# EAGLE design Precharge_circuit_logic_TNN_V1.0 (EAGLE 9.6.2)
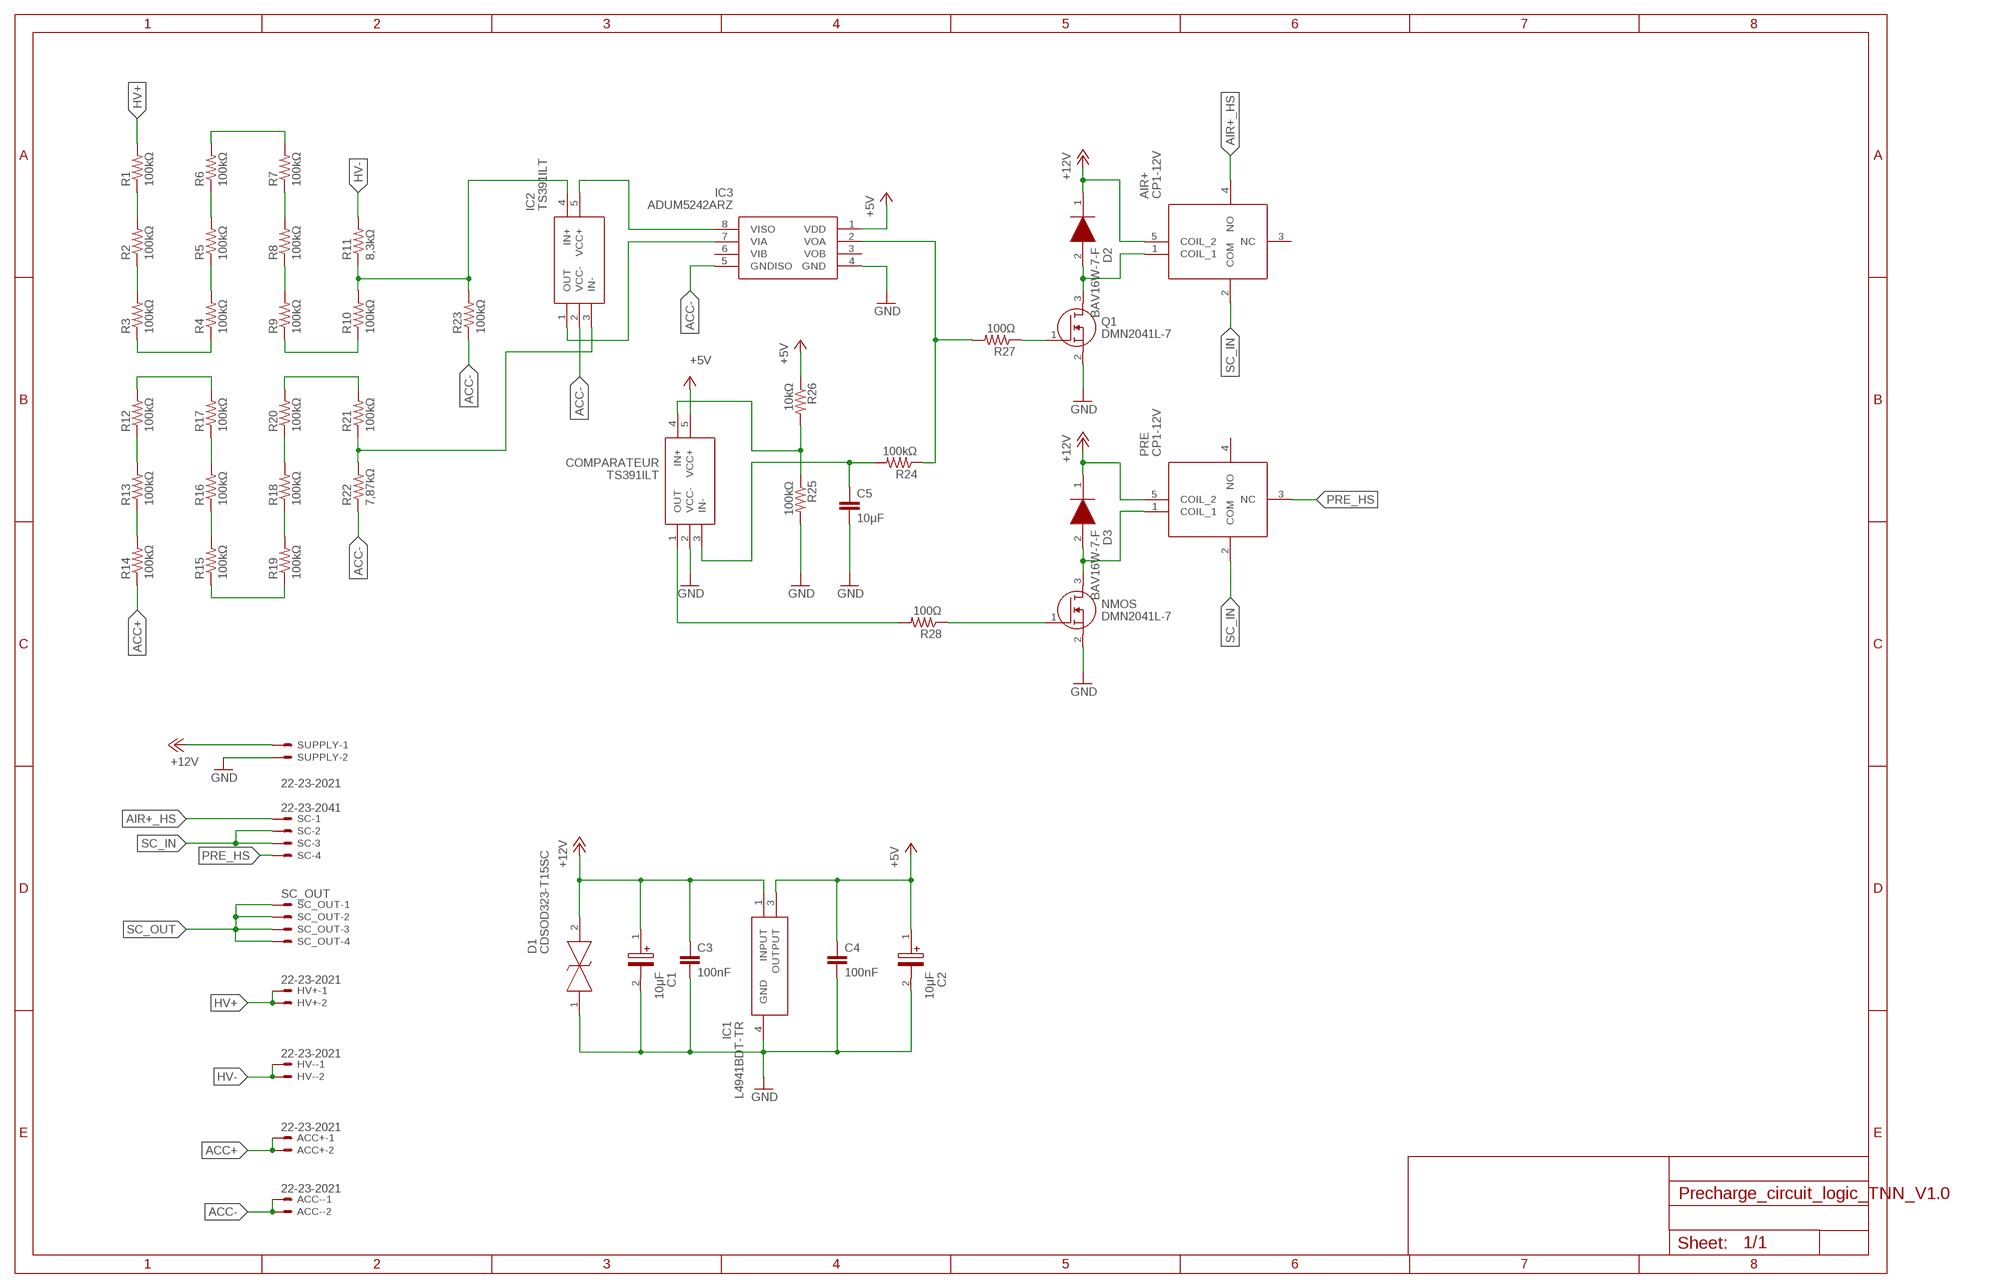
[diagram p0: schematic, sheet 1]

## Parts
ACC+  22-23-2021  [22-23-2021]
ACC-  22-23-2021  [22-23-2021]
AIR+  CP1-12V  [CP1FORMC_1]
C1  10μF  ECA1VM100  [CAPPRD200W55D525H1200]
C2  10μF  ECA1VM100  [CAPPRD200W55D525H1200]
C3  100nF  C-EUC0603  [C0603]
C4  100nF  C-EUC0603  [C0603]
C5  10μF  C-EUC0603  [C0603]
COMPARATEUR  TS391ILT  [SOT95P280X145-5N]
D1  CDSOD323-T15SC  [SOD-323]
D2  BAV16W-7-F  [SOD3716X145N]
D3  BAV16W-7-F  [SOD3716X145N]
HV+  22-23-2021  [22-23-2021]
HV-  22-23-2021  [22-23-2021]
IC1  L4941BDT-TR  [TO228P972X240-3N]
IC2  TS391ILT  [SOT95P280X145-5N]
IC3  ADUM5242ARZ  [SOIC127P600X175-8N]
NMOS  DMN2041L-7  [SOT96P240X110-3N]
PRE  CP1-12V  [CP1FORMC_1]
Q1  DMN2041L-7  [SOT96P240X110-3N]
R1  100kΩ  R-US_R0603  [R0603]
R2  100kΩ  R-US_R0603  [R0603]
R3  100kΩ  R-US_R0603  [R0603]
R4  100kΩ  R-US_R0603  [R0603]
R5  100kΩ  R-US_R0603  [R0603]
R6  100kΩ  R-US_R0603  [R0603]
R7  100kΩ  R-US_R0603  [R0603]
R8  100kΩ  R-US_R0603  [R0603]
R9  100kΩ  R-US_R0603  [R0603]
R10  100kΩ  R-US_R0603  [R0603]
R11  8,3kΩ  R-US_R0603  [R0603]
R12  100kΩ  R-US_R0603  [R0603]
R13  100kΩ  R-US_R0603  [R0603]
R14  100kΩ  R-US_R0603  [R0603]
R15  100kΩ  R-US_R0603  [R0603]
R16  100kΩ  R-US_R0603  [R0603]
R17  100kΩ  R-US_R0603  [R0603]
R18  100kΩ  R-US_R0603  [R0603]
R19  100kΩ  R-US_R0603  [R0603]
R20  100kΩ  R-US_R0603  [R0603]
R21  100kΩ  R-US_R0603  [R0603]
R22  7,87kΩ  R-US_R0603  [R0603]
R23  100kΩ  R-US_R0603  [R0603]
R24  100kΩ  R-US_R0603  [R0603]
R25  100kΩ  R-US_R0603  [R0603]
R26  10kΩ  R-US_R0603  [R0603]
R27  100Ω  R-US_R0603  [R0603]
R28  100Ω  R-US_R0603  [R0603]
SC  22-23-2041  [22-23-2041]
SC_OUT  SC_OUT  22-23-2041  [22-23-2041]
SUPPLY  22-23-2021  [22-23-2021]

## Nets
+5V: C2.1(+) C4.1 COMPARATEUR.5(VCC+) IC1.3(OUTPUT) IC3.1(VDD) R26.1
+12V: AIR+.5(COIL_2) C1.1(+) C3.1 D1.2 D2.1(K) D3.1(K) IC1.1(INPUT) PRE.5(COIL_2) SUPPLY.1
ACC+: ACC+.1 ACC+.2 R14.1
ACC-: ACC-.1 ACC-.2 IC2.2(VCC-) IC3.5(GNDISO) R22.1 R23.1
AIR+_HS: AIR+.4(NO) SC.1
GND: C1.2(-) C2.2(-) C3.2 C4.2 C5.2 COMPARATEUR.2(VCC-) D1.1 IC1.4(GND) IC3.4(GND) NMOS.2(S) Q1.2(S) R25.2 SUPPLY.2
HV+: HV+.1 HV+.2 R1.2
HV-: HV-.1 HV-.2 R11.2
N$1: R1.1 R2.2
N$2: R2.1 R3.2
N$3: R3.1 R4.1
N$4: R4.2 R5.1
N$5: R5.2 R6.1
N$6: R6.2 R7.2
N$7: R7.1 R8.2
N$8: R8.1 R9.2
N$9: R9.1 R10.1
N$10: IC2.4(IN+) R10.2 R11.1 R23.2
N$11: IC2.5(VCC+) IC3.8(VISO)
N$12: COMPARATEUR.4(IN+) R25.1 R26.2
N$13: R13.1 R14.2
N$14: R12.1 R13.2
N$15: R12.2 R17.2
N$16: R16.2 R17.1
N$17: R15.2 R16.1
N$18: R15.1 R19.1
N$19: R18.1 R19.2
N$20: R18.2 R20.1
N$21: R20.2 R21.2
N$22: IC2.3(IN-) R21.1 R22.2
N$23: D3.2(A) NMOS.3(D) PRE.1(COIL_1)
N$24: IC2.1(OUT) IC3.7(VIA)
N$25: C5.1 COMPARATEUR.3(IN-) R24.2
N$26: IC3.2(VOA) R24.1 R27.2
N$27: COMPARATEUR.1(OUT) R28.2
N$28: AIR+.1(COIL_1) D2.2(A) Q1.3(D)
N$29: NMOS.1(G) R28.1
N$30: Q1.1(G) R27.1
PRE_HS: PRE.3(NC) SC.4
SC_IN: AIR+.2(COM) PRE.2(COM) SC.2 SC.3
SC_OUT: SC_OUT.1 SC_OUT.2 SC_OUT.3 SC_OUT.4
Unconnected: AIR+.3(NC) IC3.3(VOB) IC3.6(VIB) PRE.4(NO)

## Library data of the parts
ACC+ ACC- HV+ HV- SUPPLY = con-molex:22-23-2021: .100" (2.54mm) Center Header - 2 Pin; MF: MOLEX; MPN: 22-23-2021; OC_FARNELL: 1462926; OC_NEWARK: 25C3832
AIR+ PRE = CP1-12V:CP1-12V: PANASONIC ELECTRIC WORKS - CP1-12V - RELAY, AUTOMOTIVE, SPDT, 14VDC, 20A Source: Datasheet <http://www.farnell.com/datasheets/1809465.pdf>; ARROW_PART_NUMBER: CP1-12V; ARROW_PRICE-STOCK: https://www.arrow.com/en/products/cp1-12v/panasonic?region=nac; DESCRIPTION: PANASONIC ELECTRIC WORKS - CP1-12V - RELAY, AUTOMOTIVE, SPDT, 14VDC, 20A; HEIGHT: mm; MANUFACTURER_NAME: Panasonic; MANUFACTURER_PART_NUMBER: CP1-12V; MOUSER_PART_NUMBER: 769-CP1-12V; MOUSER_PRICE-STOCK: https://www.mouser.co.uk/ProductDetail/Panasonic-Industrial-Devices/CP1-12V?qs=mTeSeKeuVA7dPPafy7M16g%3D%3D
C1 C2 = ECA1VM100:ECA1VM100: M radial Al elect cap,10uF 35V 85deg C Panasonic 10uF 35 V dc Aluminium Electrolytic Capacitor, M Series 2000h Source: Datasheet <http://industrial.panasonic.com/cdbs/www-data/pdf/RDF0000/ABA0000C1218.pdf>; DESCRIPTION: M radial Al elect cap,10uF 35V 85deg C Panasonic 10uF 35 V dc Aluminium Electrolytic Capacitor, M Series 2000h; HEIGHT: 12mm; MANUFACTURER_NAME: Panasonic; MANUFACTURER_PART_NUMBER: ECA1VM100
C3-C5 = rcl:C-EU: CAPACITOR, European symbol; SPICEPREFIX: C
COMPARATEUR IC2 = TS391ILT:TS391ILT: TS391ILT, Comparator Open Collector 0.3us 12 V, 15 V, 18 V, 24 V, 28 V, 3 V, 5 V, 9 V 5-Pin SOT-23 Source: Datasheet <http://www.st.com/st-web-ui/static/active/en/resource/technical/document/datasheet/CD00001660.pdf>; ARROW_PART_NUMBER: TS391ILT; ARROW_PRICE-STOCK: https://www.arrow.com/en/products/ts391ilt/stmicroelectronics?region=nac; DESCRIPTION: TS391ILT, Comparator Open Collector 0.3us 12 V, 15 V, 18 V, 24 V, 28 V, 3 V, 5 V, 9 V 5-Pin SOT-23; HEIGHT: 1.45mm; MANUFACTURER_NAME: STMicroelectronics; MANUFACTURER_PART_NUMBER: TS391ILT; MOUSER_PART_NUMBER: 511-TS391IL; MOUSER_PRICE-STOCK: https://www.mouser.co.uk/ProductDetail/STMicroelectronics/TS391ILT?qs=P8h1tZw8GcB9GWR61XM17g%3D%3D
D1 = CDSOD323-T15SC:CDSOD323-T15SC: TVS Diode ESD 15V BiDirectional SOD323 Bourns CDSOD323-T15SC Bi-Directional TVS Diode, 400W peak, 2-Pin SOD-323 Source: Datasheet <https://datasheet.datasheetarchive.com/originals/distributors/Datasheets-DGA26/1841678.pdf>; ARROW_PART_NUMBER: CDSOD323-T15SC; ARROW_PRICE-STOCK: https://www.arrow.com/en/products/cdsod323-t15sc/bourns?region=nac; DESCRIPTION: TVS Diode ESD 15V BiDirectional SOD323 Bourns CDSOD323-T15SC Bi-Directional TVS Diode, 400W peak, 2-Pin SOD-323; HEIGHT: mm; MANUFACTURER_NAME: Bourns; MANUFACTURER_PART_NUMBER: CDSOD323-T15SC; MOUSER_PART_NUMBER: 652-CDSOD323-T15SC; MOUSER_PRICE-STOCK: https://www.mouser.co.uk/ProductDetail/Bourns/CDSOD323-T15SC?qs=6S5Watp5UnLvz%2FtnS7XuhA%3D%3D
D2 D3 = BAV16W-7-F:BAV16W-7-F: Diode Switching 100V 0.15A 2Pin SOD123 Diodes Inc BAV16W-7-F Switching Diode, 300mA 100V, 2-Pin SOD-123 Source: Datasheet <https://datasheet.datasheetarchive.com/originals/distributors/SFDatasheet-0/sf-0003309.pdf>; ARROW_PART_NUMBER: BAV16W-7-F; ARROW_PRICE-STOCK: https://www.arrow.com/en/products/bav16w-7-f/diodes-incorporated; DESCRIPTION: Diode Switching 100V 0.15A 2Pin SOD123 Diodes Inc BAV16W-7-F Switching Diode, 300mA 100V, 2-Pin SOD-123; HEIGHT: 1.45mm; MANUFACTURER_NAME: Diodes Inc.; MANUFACTURER_PART_NUMBER: BAV16W-7-F; MOUSER_PART_NUMBER: 621-BAV16W-F; MOUSER_PRICE-STOCK: https://www.mouser.co.uk/ProductDetail/Diodes-Incorporated/BAV16W-7-F?qs=Ge55vsXlF7cElS2bbKfO8A%3D%3D
IC1 = L4941BDT-TR:L4941BDT-TR: L4941BDT-TR, Low Dropout Voltage Regulator, 1A, 5 V +/-4%, 3-Pin DPAK Source: Datasheet <http://www.st.com/web/en/resource/technical/document/datasheet/CD00000443.pdf>; ARROW_PART_NUMBER: L4941BDT-TR; ARROW_PRICE-STOCK: https://www.arrow.com/en/products/l4941bdt-tr/stmicroelectronics?region=nac; DESCRIPTION: L4941BDT-TR, Low Dropout Voltage Regulator, 1A, 5 V +/-4%, 3-Pin DPAK; HEIGHT: 2.4mm; MANUFACTURER_NAME: STMicroelectronics; MANUFACTURER_PART_NUMBER: L4941BDT-TR; MOUSER_PART_NUMBER: 511-L4941BDT-TR; MOUSER_PRICE-STOCK: https://www.mouser.co.uk/ProductDetail/STMicroelectronics/L4941BDT-TR?qs=tPFdqECvbMIySYN92F2N4Q%3D%3D
IC3 = ADUM5242ARZ:ADUM5242ARZ: Analog Devices ADUM5242ARZ PCB SMT 2-channel Digital Isolator, 2500 V, 8-Pin SOIC Source: Datasheet; ARROW_PART_NUMBER: ADUM5242ARZ; ARROW_PRICE-STOCK: https://www.arrow.com/en/products/adum5242arz/analog-devices; DESCRIPTION: Analog Devices ADUM5242ARZ PCB SMT 2-channel Digital Isolator, 2500 V, 8-Pin SOIC; HEIGHT: mm; MANUFACTURER_NAME: Analog Devices; MANUFACTURER_PART_NUMBER: ADUM5242ARZ; MOUSER_PART_NUMBER: 584-ADUM5242ARZ; MOUSER_PRICE-STOCK: https://www.mouser.co.uk/ProductDetail/Analog-Devices/ADUM5242ARZ?qs=WIvQP4zGanhQ0%252B41E0Savw%3D%3D
NMOS Q1 = DMN2041L-7:DMN2041L-7: Diodes Inc DMN2041L-7 N-channel MOSFET Transistor, 6.4 A, 20 V, 3-Pin SOT-23 Source: Datasheet <https://datasheet.datasheetarchive.com/originals/distributors/Datasheets-DGA23/1582050.pdf>; ARROW_PART_NUMBER: DMN2041L-7; ARROW_PRICE-STOCK: https://www.arrow.com/en/products/dmn2041l-7/diodes-incorporated?region=nac; DESCRIPTION: Diodes Inc DMN2041L-7 N-channel MOSFET Transistor, 6.4 A, 20 V, 3-Pin SOT-23; HEIGHT: 1.1mm; MANUFACTURER_NAME: Diodes Inc.; MANUFACTURER_PART_NUMBER: DMN2041L-7; MOUSER_PART_NUMBER: 621-DMN2041L-7; MOUSER_PRICE-STOCK: https://www.mouser.co.uk/ProductDetail/Diodes-Incorporated/DMN2041L-7?qs=tiksPeNXt0LSbn3jTreVOg%3D%3D
R1-R28 = rcl:R-US_: RESISTOR, American symbol; SPICEPREFIX: R
SC SC_OUT = con-molex:22-23-2041: .100" (2.54mm) Center Header - 4 Pin; MF: MOLEX; MPN: 22-23-2041; OC_FARNELL: 1462920; OC_NEWARK: 38C0355

## Board
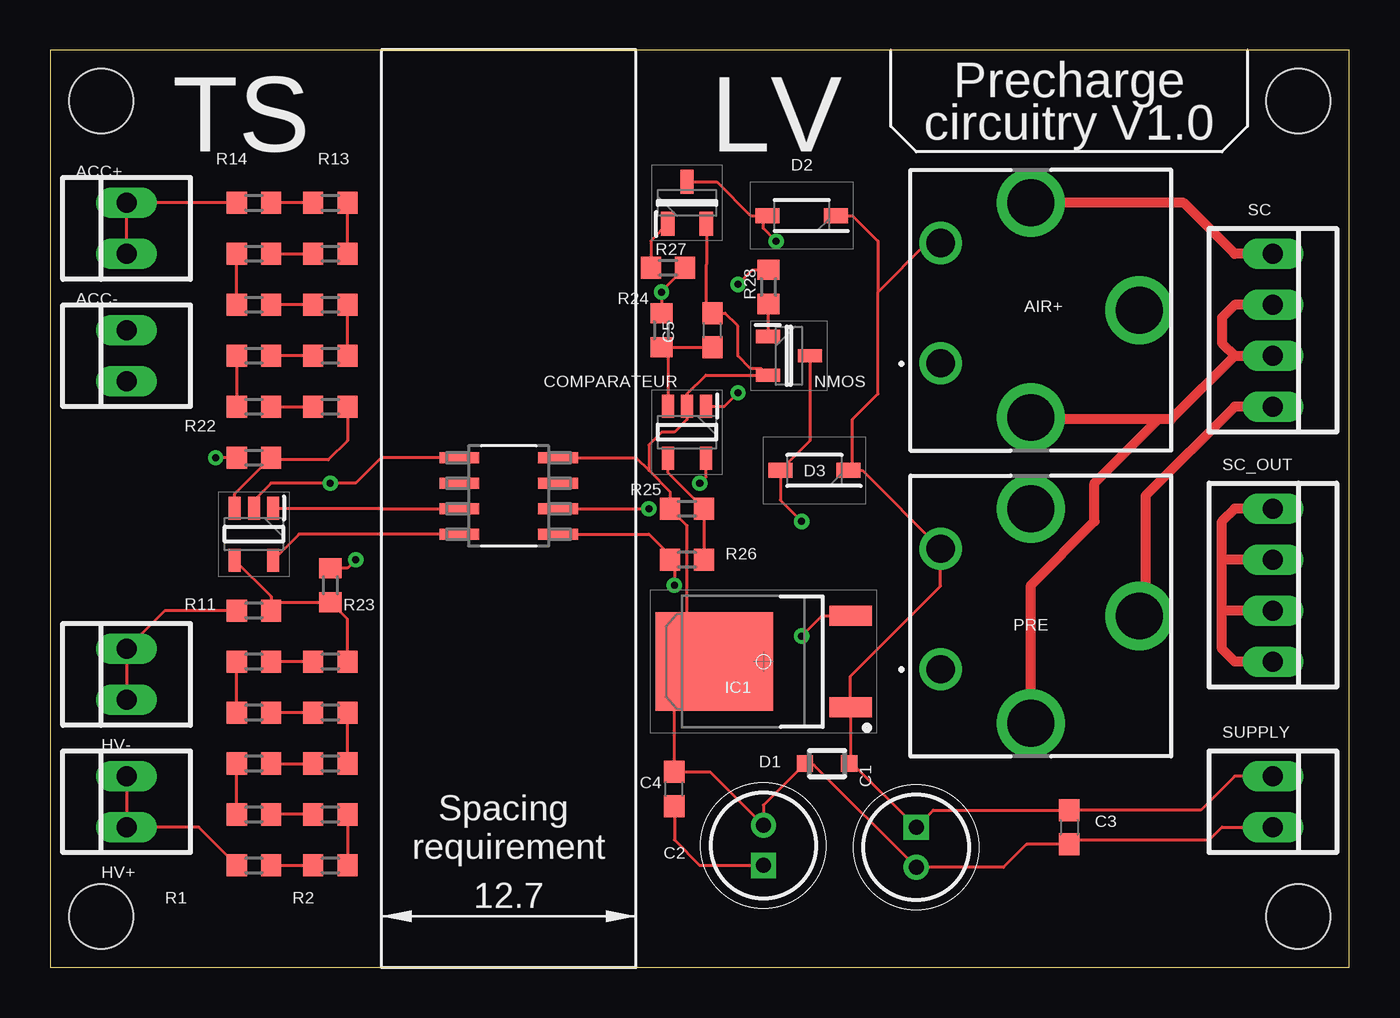
[diagram p1: board, top side]
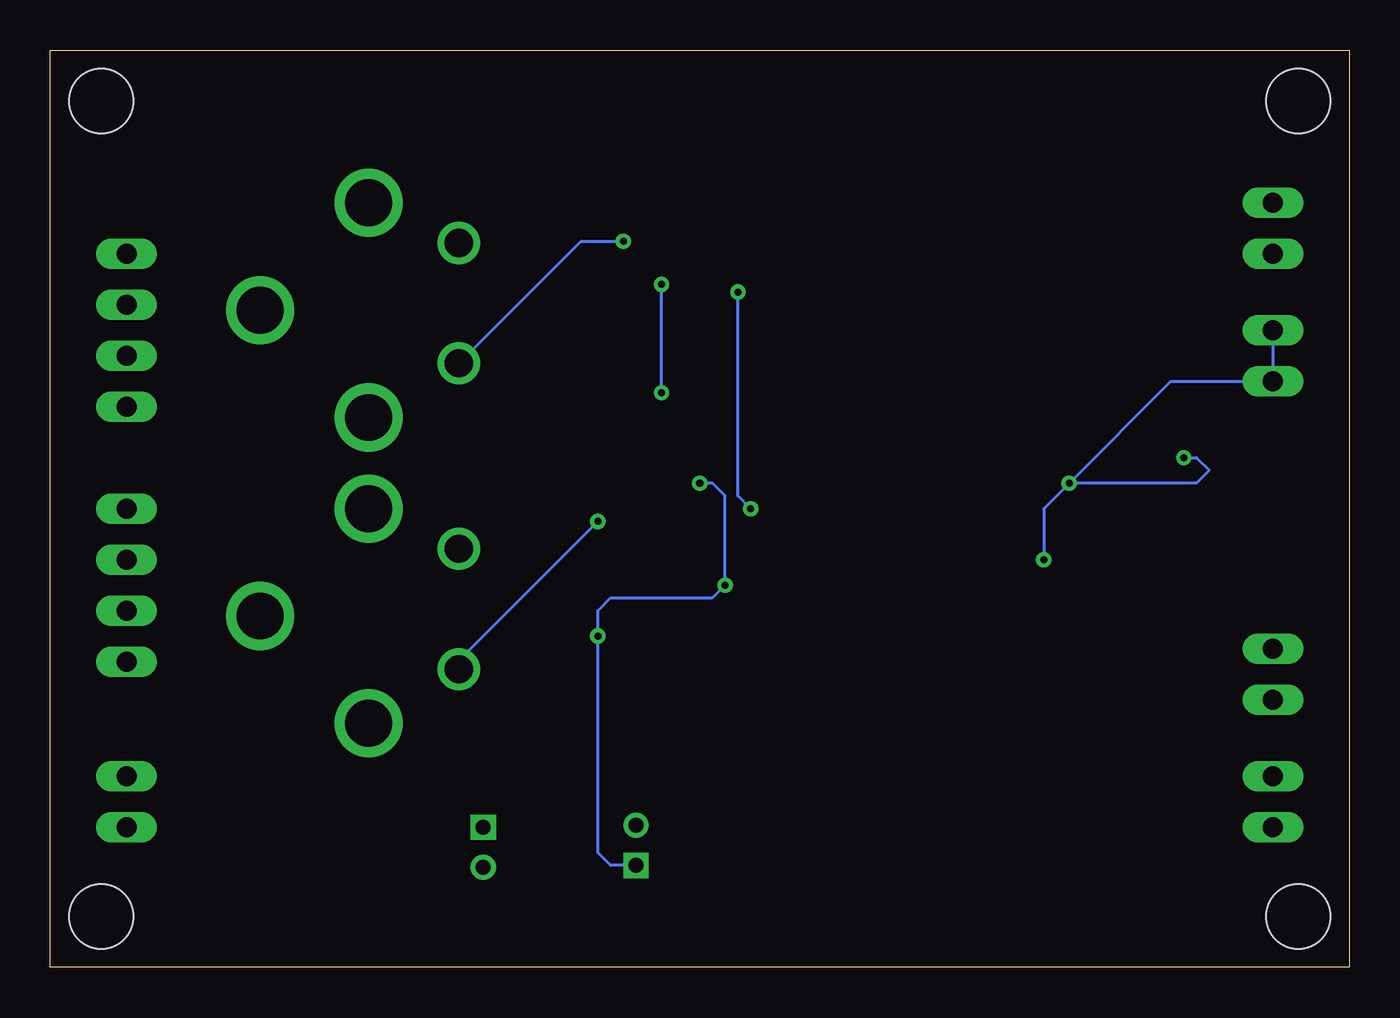
[diagram p2: board, bottom side, seen from below]

Size 64.77 x 45.71 mm. Coordinates in mm from the lower left corner, seen from the top.
Outline: 0,0 64.77,0 64.77,45.71 0,45.71 0,0
Copper layers (1*16): Top 0.035mm / dielectric 1.5mm / Bottom 0.035mm
Design rules "default": minimum track width 6mil, minimum drill 0.35mm, track to track 6mil, track to pad 6mil, pad to pad 6mil, via to via 6mil, smd to smd 6mil, copper to edge 40mil, drill to drill 6mil, minimum pad ring 10mil, minimum via ring 8mil, stop-mask expansion 4mil, vias tented up to drill 0mil, thermal gap 10mil
Holes 3.2 mm at 2.54,43.18 62.23,2.54 2.54,2.54 62.23,43.18

### Footprints (pad centres in the part's own frame; a part is rotated, then mirrored left to right if it is on the bottom)
22-23-2021 = drill 1 long: 1 -1.27,0; 2 1.27,0
CP1FORMC_1 = drill 1.4 pad 2.1: 1 -8,4.5; 5 -2,4.5 | drill 2.33 pad 3.4: 2 -10.7,0; 3 -5.35,-5.4; 4 0,0
CAPPRD200W55D525H1200 = drill 0.75 pad 1.15 square: 1 0,0 | drill 0.75 pad 1.15: 2 2,0
C0603 = smd 1.1 x 1: 1 -0.85,0; 2 0.85,0
SOT95P280X145-5N = smd 1.15 x 0.6: 1 -1.3,0.95; 2 -1.3,0; 3 -1.3,-0.95; 4 1.3,-0.95; 5 1.3,0.95
SOD-323 = smd 0.8 x 0.8: 1 -1.1,0; 2 1.1,0
SOD3716X145N = smd 1.2 x 0.75: 1 -1.7,0; 2 1.7,0
TO228P972X240-3N = smd 2.1 x 1: 1 -4.35,2.28; 3 -4.35,-2.28 | smd 5.85 x 4.9: 4 2.45,0
SOIC127P600X175-8N = smd 1.981 x 0.559: 1 -2.464,1.905; 2 -2.464,0.635; 3 -2.464,-0.635; 4 -2.464,-1.905; 5 2.464,-1.905; 6 2.464,-0.635; 7 2.464,0.635; 8 2.464,1.905
SOT96P240X110-3N = smd 1.2 x 0.65: 1 -1.05,0.96; 2 -1.05,-0.96; 3 1.05,0
R0603 = smd 1 x 1.1: 1 -0.85,0; 2 0.85,0
22-23-2041 = drill 1 long: 1 -3.81,0; 2 -1.27,0; 3 1.27,0; 4 3.81,0

### Placement (x,y rotation side)
ACC+  3.81,36.83 90 top
ACC-  3.81,30.48 90 top
AIR+  48.9,38.1 90 top
C1  43.18,6.98 270 top
C2  35.56,5.08 90 top
C3  50.8,6.98 270 top
C4  31.11,8.89 90 top
C5  33.02,31.75 90 top
COMPARATEUR  31.75,26.67 270 top
D1  38.73,10.16 0 top
D2  37.47,37.47 180 top
D3  38.1,24.77 180 top
HV+  3.81,8.26 90 top
HV-  3.81,14.61 90 top
IC1  35.56,15.24 180 top
IC2  10.16,21.59 270 top
IC3  22.86,23.5 180 top
NMOS  36.83,30.48 0 top
PRE  48.9,22.86 90 top
Q1  31.75,38.1 90 top
R1  10.16,5.08 180 top
R2  13.97,5.08 180 top
R3  13.97,7.62 0 top
R4  10.16,7.62 180 top
R5  10.16,10.16 0 top
R6  13.97,10.16 0 top
R7  13.97,12.7 0 top
R8  10.16,12.7 0 top
R9  10.16,15.24 180 top
R10  13.97,15.24 0 top
R11  10.16,17.78 180 top
R12  13.97,35.56 180 top
R13  13.97,38.1 0 top
R14  10.16,38.1 0 top
R15  13.97,33.02 180 top
R16  10.16,33.02 180 top
R17  10.16,35.56 0 top
R18  10.16,30.48 180 top
R19  13.97,30.48 180 top
R20  10.16,27.94 0 top
R21  13.97,27.94 180 top
R22  10.16,25.4 0 top
R23  13.97,19.05 270 top
R24  30.48,31.75 270 top
R25  31.75,22.86 180 top
R26  31.75,20.32 0 top
R27  30.8,34.86 0 top
R28  35.81,33.91 90 top
SC  60.96,31.75 270 top
SC_OUT  60.96,19.05 270 top
SUPPLY  60.96,8.26 270 top

### Tracks (layer width: path | path; a pad name or v marks a point on that pad's centre or on a via)
+5V  (via drill 0.35)
  Top 0.152: C4.1 31.11,6.35 32.38,5.08 C2.1 | v32.38,24.13 32.7,24.45 COMPARATEUR.5 | IC1.3 38.48,17.52 v37.47,16.51 | R26.1 31.01,20.21 | 31.01,20.21 31.11,20.11 v31.11,19.05 | IC3.1 29.84,21.59 31.01,20.43 31.01,20.21
  Bottom 0.152: C2.1 36.83,5.08 37.47,5.71 v37.47,16.51 37.47,17.78 36.83,18.41 31.75,18.41 v31.11,19.05 31.11,23.5 31.75,24.13 v32.38,24.13
+12V
  Top 0.152: 41.27,33.66 41.27,28.57 40.01,27.3 40.01,24.97 D3.1 40.49,24.77 PRE.5 44.4,19 39.91,14.51 IC1.1 39.91,10.23 D1.2 40.01,10.16 C1.1 44.03,7.84 C3.1 57.37,7.84 59.05,9.53 SUPPLY.1 | 41.27,33.66 43.72,36.1 AIR+.5 | D2.1 40.01,37.47 41.27,36.2 41.27,33.66
ACC+
  Top 0.152: R14.1 ACC+.2 ACC+.1
ACC-  (via drill 0.35)
  Top 0.152: IC3.5 16.51,25.4 15.24,24.13 v13.97,24.13 11.02,24.13 10.16,23.27 IC2.2 | v15.24,20.32 14.82,19.9 R23.1 | R22.1 v8.26,25.4
  Bottom 0.152: v13.97,24.13 8.89,29.21 ACC-.1 ACC-.2 | v13.97,24.13 15.24,22.86 v15.24,20.32 | v8.26,25.4 7.62,25.4 6.99,24.77 7.62,24.13 v13.97,24.13
AIR+_HS
  Top 0.508: SC.1 59.05,35.56 56.52,38.1 AIR+.4
GND
  Top 0.152: D1.1 37.55,10.07 | 37.55,10.07 35.56,8.09 C2.2 32.9,9.74 C4.2 31.11,13.24 IC1.4 31.75,16.6 31.75,22.01 R25.2 30.9,23.71 29.84,24.77 | Q1.2 32.71,35.04 32.71,32.91 C5.2 33.66,32.6 34.29,31.96 34.29,30.48 34.92,29.84 35.45,29.84 NMOS.2 32.7,29.52 31.75,28.57 COMPARATEUR.2 31.75,27.3 31.11,26.67 30.48,26.67 29.84,26.04 29.84,24.77 | IC3.4 29.21,25.4 29.84,24.77 | 37.55,10.07 38.09,10.07 C1.2 47.53,4.98 48.68,6.13 C3.2 51.02,6.35 57.78,6.35 58.42,6.98 SUPPLY.2
HV+
  Top 0.152: R1.2 7.41,6.98 HV+.1 HV+.2
HV-
  Top 0.152: R11.2 5.71,17.78 HV-.2 HV-.1
N$1
  Top 0.152: R1.1 R2.2
N$2
  Top 0.152: R3.2 R2.1
N$3
  Top 0.152: R3.1 R4.1
N$4
  Top 0.152: R4.2 R5.1
N$5
  Top 0.152: R5.2 R6.1
N$6
  Top 0.152: R6.2 R7.2
N$7
  Top 0.152: R7.1 R8.2
N$8
  Top 0.152: R8.1 R9.2
N$9
  Top 0.152: R10.1 R9.1
N$10
  Top 0.152: IC2.4 11.01,18.49 R11.1 11.43,18.2 R23.2 14.82,17.35 R10.2
N$11
  Top 0.152: IC2.5 12.41,21.59 IC3.8
N$12
  Top 0.152: COMPARATEUR.4 30.8,24.66 R25.1 R26.2
N$13
  Top 0.152: R13.1 R14.2
N$14
  Top 0.152: R12.1 R13.2
N$15
  Top 0.152: R17.2 R12.2
N$16
  Top 0.152: R16.2 R17.1
N$17
  Top 0.152: R15.2 R16.1
N$18
  Top 0.152: R19.1 R15.1
N$19
  Top 0.152: R19.2 R18.1
N$20
  Top 0.152: R18.2 R20.1
N$21
  Top 0.152: R20.2 R21.2
N$22
  Top 0.152: IC2.3 9.21,23.6 10.9,25.29 | 10.9,25.29 R22.2 | R21.1 14.82,26.25 13.86,25.29 10.9,25.29
N$23  (via drill 0.35)
  Top 0.152: NMOS.3 37.88,26.25 D3.2 36.4,23.29 v37.47,22.22
  Bottom 0.152: v37.47,22.22 44.4,15.29 PRE.1
N$24
  Top 0.152: IC2.1 16.48,22.89 16.51,22.86 IC3.7
N$25
  Top 0.152: C5.1 R24.2 30.8,30.58 COMPARATEUR.3
N$26  (via drill 0.35)
  Top 0.152: IC3.2 v29.84,22.86 | R24.1 v30.48,33.66 30.48,33.69 R27.2
  Bottom 0.152: v29.84,22.86 30.48,23.5 v30.48,33.66
N$27  (via drill 0.35)
  Top 0.152: COMPARATEUR.1 33.62,27.97 v34.29,28.64 | v34.29,34.04 35.01,34.76 R28.2
  Bottom 0.152: v34.29,28.64 v34.29,34.04
N$28  (via drill 0.35)
  Top 0.152: Q1.3 33.24,39.15 34.92,37.47 35.56,37.47 | 35.56,37.47 D2.2 | v36.2,36.2 35.56,36.83 35.56,37.47
  Bottom 0.152: AIR+.1 38.3,36.2 v36.2,36.2
N$29
  Top 0.152: R28.1 35.78,33.02 NMOS.1
N$30
  Top 0.152: Q1.1 29.95,36.21 R27.1
PRE_HS
  Top 0.508: SC.4 59.05,27.94 54.61,23.5 54.61,17.82 PRE.3
SC_IN
  Top 0.508: SC.2 59.05,33.02 58.42,32.38 58.42,31.11 59.05,30.48 | 59.05,30.48 SC.3 | 55.24,27.3 55.88,27.3 59.05,30.48 | 55.24,27.3 48.99,27.3 AIR+.2 | PRE.2 48.9,19.05 52.07,22.22 52.07,24.13 55.24,27.3
SC_OUT
  Top 0.508: SC_OUT.1 59.05,22.86 58.42,22.22 58.42,20.32 | SC_OUT.2 58.42,20.32 | SC_OUT.3 58.42,17.78 | 58.42,17.78 58.42,20.32 | SC_OUT.4 59.05,15.24 58.42,15.88 58.42,17.78

### Text on the board
tNames: Precharge / circuitry V1.0 | TS | LV | Spacing / requirement